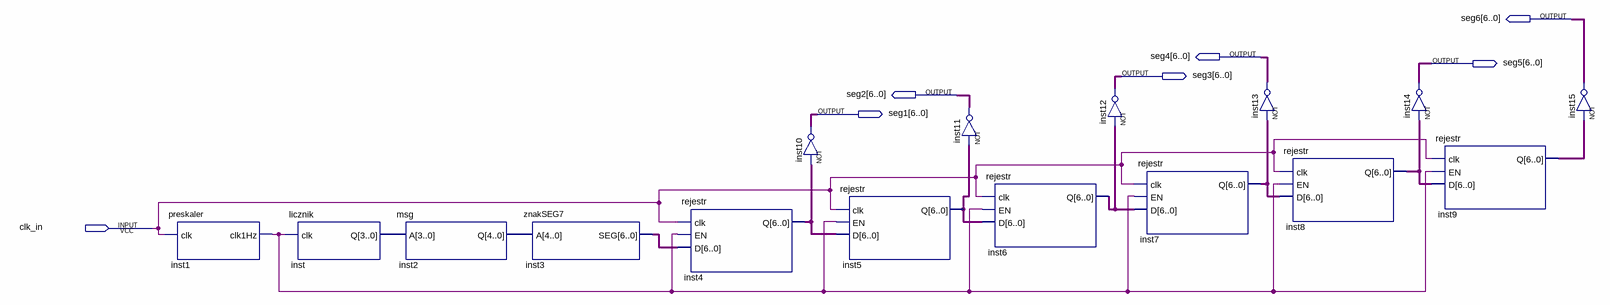
[diagram p0: schematic sheet]
// Quartus schematic reklama.bdf as structural Verilog: 16 symbols, 7 pins
module reklama (
  input  clk_in,
  output [6:0] seg6,
  output [6:0] seg4,
  output [6:0] seg5,
  output [6:0] seg3,
  output [6:0] seg2,
  output [6:0] seg1
);

  wire inst1_clk1hz;
  wire [3:0] inst_q;
  wire [4:0] inst2_q;
  wire [6:0] inst3_seg, inst4_q, inst5_q, inst6_q, inst7_q, inst8_q, inst9_q;

  preskaler inst1 (.clk(clk_in), .clk1Hz(inst1_clk1hz));
  licznik inst (.clk(inst1_clk1hz), .Q(inst_q));
  msg inst2 (.A(inst_q), .Q(inst2_q));
  znakSEG7 inst3 (.A(inst2_q), .SEG(inst3_seg));
  rejestr inst4 (.clk(clk_in), .EN(inst1_clk1hz), .D(inst3_seg), .Q(inst4_q));
  assign seg1 = ~inst4_q;  // NOT inst10, 7 bits wide
  rejestr inst5 (.clk(clk_in), .EN(inst1_clk1hz), .D(inst4_q), .Q(inst5_q));
  assign seg2 = ~inst5_q;  // NOT inst11, 7 bits wide
  rejestr inst6 (.clk(clk_in), .EN(inst1_clk1hz), .D(inst5_q), .Q(inst6_q));
  assign seg3 = ~inst6_q;  // NOT inst12, 7 bits wide
  rejestr inst7 (.clk(clk_in), .EN(inst1_clk1hz), .D(inst6_q), .Q(inst7_q));
  assign seg4 = ~inst7_q;  // NOT inst13, 7 bits wide
  rejestr inst8 (.clk(clk_in), .EN(inst1_clk1hz), .D(inst7_q), .Q(inst8_q));
  assign seg5 = ~inst8_q;  // NOT inst14, 7 bits wide
  rejestr inst9 (.clk(clk_in), .EN(inst1_clk1hz), .D(inst8_q), .Q(inst9_q));
  assign seg6 = ~inst9_q;  // NOT inst15, 7 bits wide
endmodule
